# Altium schematic sheet 10.SchDoc
size 297 x 209 mm
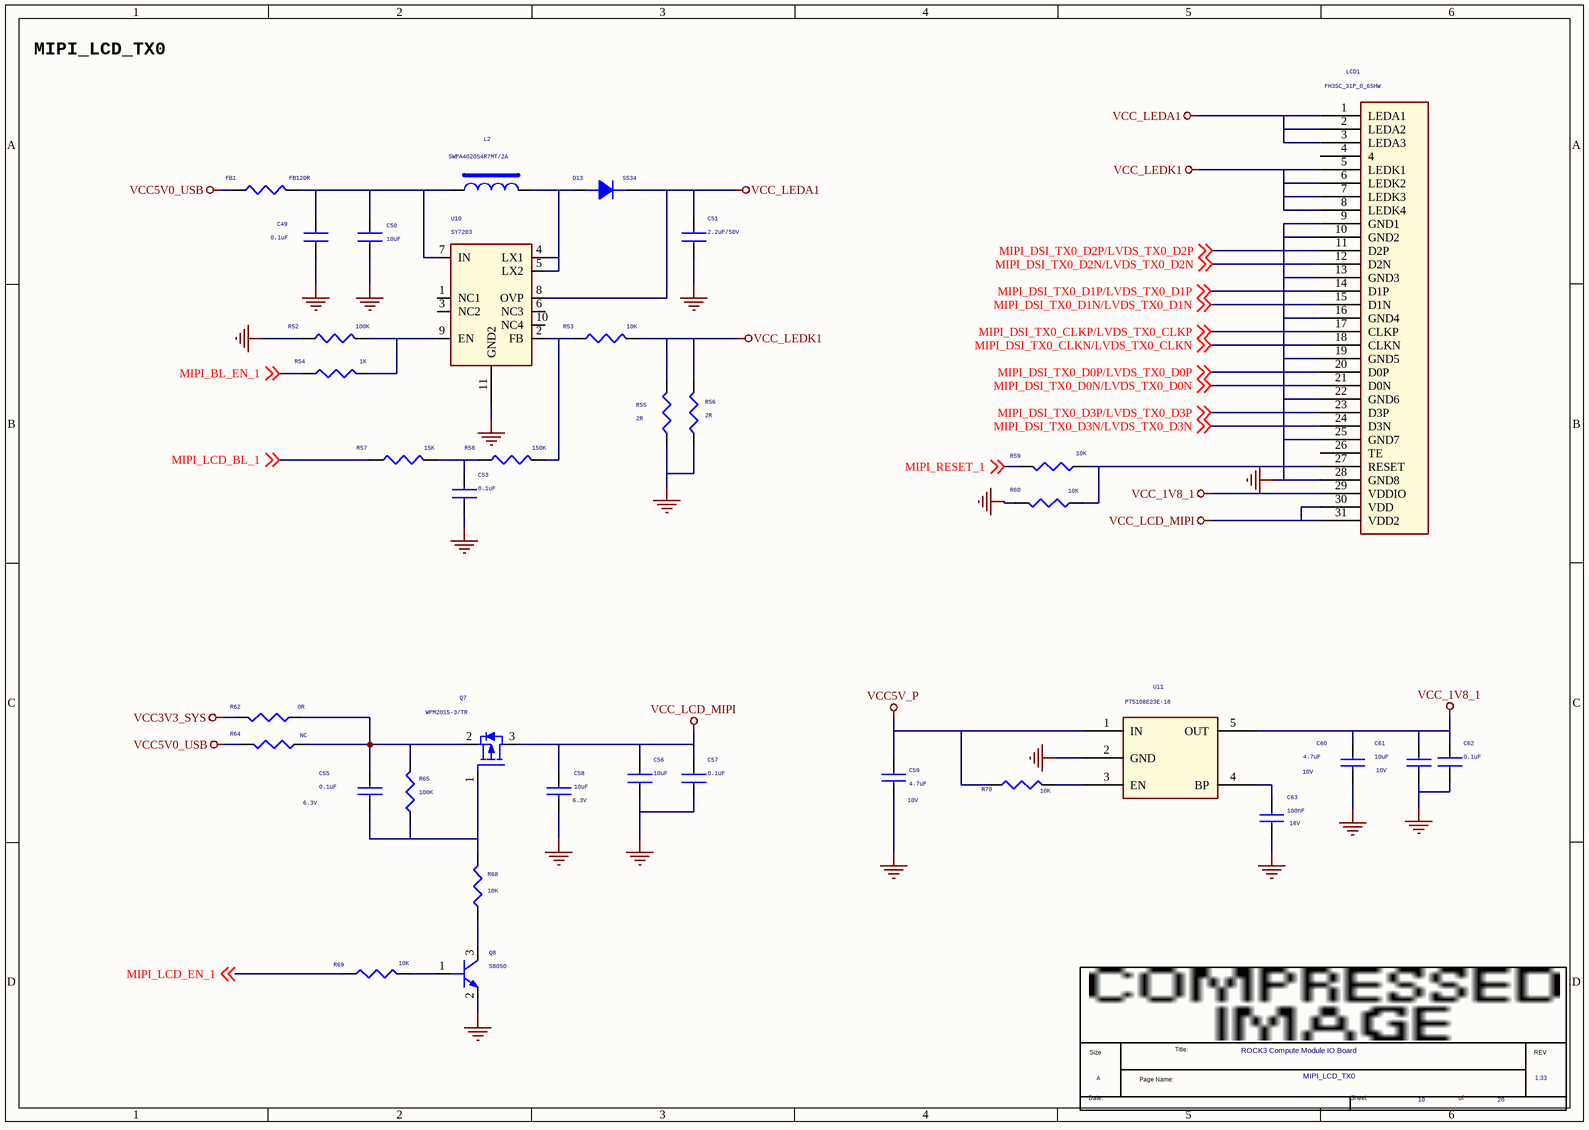
[diagram p0: 10.SchDoc]

## Parts
*  Page Count: 20  Page Number: 10  Page Size: A  Title: ROCK3 Compute Module IO Board  RevCode: 1.33  Doc: MIPI_LCD_TX0  (hidden comment: radxa_1010)  (graphical)
C49  0.1uF  [C0603]
C50  10uF  [C0603]
C51  2.2uF/50V  [C0603]
C53  0.1uF  [C0603]
C55  0.1uF  Voltage: 6.3V  [C0402]
C56  10uF  [C0603]
C57  0.1uF  [C0603]
C58  10uF  Voltage: 6.3V  [C0603]
C59  4.7uF  Voltage: 10V  [C0603]
C60  4.7uF  Voltage: 10V  [C0603]
C61  10uF  Voltage: 10V  [C0603]
C62  0.1uF  [C0603]
C63  100nF  Voltage: 16V  [C0402]
D13  SS34  [DO214AC]
FB1  FB120R  [R0603]
L2  SWPA4020S4R7MT/2A  [IND-4X4]
LCD1  FH35C_31P_0_6SHW  [HQ101WX001]
Q7  WPM2015-3/TR  [SOT23]
Q8  S8050  [SOT23]
R52  100K  [R0402]
R53  10K  [R0402]
R54  1K  [R0402]
R55  2R  [R0805]
R56  2R  [R0805]
R57  15K  [R0402]
R58  150K  [R0402]
R59  10K  [R0402]
R60  10K  [R0402]
R62  0R  [R0603]
R64  NC  [R0603]
R65  100K  [R0402]
R68  10K  [R0402]
R69  10K  [R0402]
R70  10K  [R0402]
U10  SY7203  [QFN8-2X2]
U11  PT5108E23E-18  [SOT25]

## Nets
GND: C49.2 C50.2 C51.2 C53.1 C56.2 C57.2 C58.2 C59.2 C60.2 C61.2 C62.2 C63.2 LCD1.9(GND1) LCD1.10(GND2) LCD1.13(GND3) LCD1.16(GND4) LCD1.19(GND5) LCD1.22(GND6) LCD1.25(GND7) LCD1.28(GND8) Q8.2(EMITTER) R52.1 R55.2 R56.2 R60.2 U10.11(GND2) U11.2(GND)
VCC3V3_SYS: R62.1
VCC5V0_USB: FB1.1 R64.1
VCC5V_P: C59.1 R70.1 U11.1(IN)
VCC_1V8_1: C60.1 C61.1 C62.1 LCD1.29(VDDIO) U11.5(OUT)
VCC_LCD_MIPI: C56.1 C57.1 C58.1 LCD1.30(VDD) LCD1.31(VDD2) Q7.3(DRAIN)
VCC_LEDA1: C51.1 D13.2(K) LCD1.1(LEDA1) LCD1.2(LEDA2) LCD1.3(LEDA3) U10.8(OVP)
VCC_LEDK1: LCD1.5(LEDK1) LCD1.6(LEDK2) LCD1.7(LEDK3) LCD1.8(LEDK4) R53.2 R55.1 R56.1
MIPI_BL_EN_1: R54.1 ; off-sheet MIPI_BL_EN_1
MIPI_DSI_TX0_CLKN/LVDS_TX0_CLKN: LCD1.18(CLKN) ; off-sheet MIPI_DSI_TX0_CLKN/LVDS_TX0_CLKN
MIPI_DSI_TX0_CLKP/LVDS_TX0_CLKP: LCD1.17(CLKP) ; off-sheet MIPI_DSI_TX0_CLKP/LVDS_TX0_CLKP
MIPI_DSI_TX0_D0N/LVDS_TX0_D0N: LCD1.21(D0N) ; off-sheet MIPI_DSI_TX0_D0N/LVDS_TX0_D0N
MIPI_DSI_TX0_D0P/LVDS_TX0_D0P: LCD1.20(D0P) ; off-sheet MIPI_DSI_TX0_D0P/LVDS_TX0_D0P
MIPI_DSI_TX0_D1N/LVDS_TX0_D1N: LCD1.15(D1N) ; off-sheet MIPI_DSI_TX0_D1N/LVDS_TX0_D1N
MIPI_DSI_TX0_D1P/LVDS_TX0_D1P: LCD1.14(D1P) ; off-sheet MIPI_DSI_TX0_D1P/LVDS_TX0_D1P
MIPI_DSI_TX0_D2N/LVDS_TX0_D2N: LCD1.12(D2N) ; off-sheet MIPI_DSI_TX0_D2N/LVDS_TX0_D2N
MIPI_DSI_TX0_D2P/LVDS_TX0_D2P: LCD1.11(D2P) ; off-sheet MIPI_DSI_TX0_D2P/LVDS_TX0_D2P
MIPI_DSI_TX0_D3N/LVDS_TX0_D3N: LCD1.24(D3N) ; off-sheet MIPI_DSI_TX0_D3N/LVDS_TX0_D3N
MIPI_DSI_TX0_D3P/LVDS_TX0_D3P: LCD1.23(D3P) ; off-sheet MIPI_DSI_TX0_D3P/LVDS_TX0_D3P
MIPI_LCD_BL_1: R57.1 ; off-sheet MIPI_LCD_BL_1
MIPI_LCD_EN_1: R69.1 ; off-sheet MIPI_LCD_EN_1
MIPI_RESET_1: R59.2 ; off-sheet MIPI_RESET_1
NetC49_1: C49.1 C50.1 FB1.2 L2.1 U10.7(IN)
NetC53_2: C53.2 R57.2 R58.1
NetC55_1: C55.1 Q7.2(SOURCE) R62.2 R64.2 R65.1
NetC55_2: C55.2 Q7.1(GATE) R65.2 R68.1
NetC63_1: C63.1 U11.4(BP)
NetD13_1: D13.1(A) L2.2 U10.4(LX1) U10.5(LX2)
NetLCD1_27: LCD1.27(RESET) R59.1 R60.1
NetQ8_1: Q8.1(BASE) R69.2
NetQ8_3: Q8.3(COLLECTOR) R68.2
NetR52_2: R52.2 R54.2 U10.9(EN)
NetR53_1: R53.1 R58.2 U10.2(FB)
NetR70_2: R70.2 U11.3(EN)

Not connected (* = marked no-connect by the designer): LCD1 4 26(TE); U10 1(NC1) 3(NC2) 6(NC3) 10(NC4)

## Notes on the sheet
- MIPI_LCD_TX0
- (in symbol radxa_1010) Title:; Size; REV; Page Name:; Date:; Sheet; of

## Library data of the parts
C49 C57 C62 = CAP NP: CAP,MLCC,100nF,+/-10%,X7R,6.3V,SMD0402
C50 = CAP NP
C51 = CAP NP: RoHS CHIP CAP 1uF +10/-10% 25V X5R
C53 = CAP NP: RoHS CHIP CAP 0.1uF +10/-10% X7R
C55 = CAP NP_0: cap,100.00nF,+/-10%,6.3V,X5R,C0402; Manufacturer PN: C1005X5R0J104K050BA; Manufacturer: TDK; Tolerance: 10%; Priority: A; Dielectric: X5R; Created by: JJJ; Part Type: C0402; RK PN: C1005X5R0J104K050BA
C56 = CAP NP: CAP,MLCC,4.7uF,+/-10%,X5R,6.3V,SMD0603
C58 = CAP NP_0: cap,4.70uF,+/-10%,6.3V,X5R,C0603; Manufacturer PN: C1608X5R0J475K080AB; Manufacturer: TDK; Tolerance: 10%; Priority: A; Dielectric: X5R; Created by: JJJ; Part Type: C0603; RK PN: C1608X5R0J475K080AB
C59 C60 = CAP NP_0: cap,4.70uF,+/-10%,10V,X5R,C0603; Manufacturer PN: C1608X5R1A475K080AC; Manufacturer: TDK; Tolerance: 10%; Priority: A; Dielectric: X5R; Created by: JJJ; Part Type: C0603; RK PN: C1608X5R1A475K080AC
C61 = CAP NP_0: cap,10.00uF,+/-10%,10V,X5R,C0805; Manufacturer PN: C2012X5R1A106K125AB; Manufacturer: TDK; Tolerance: 10%; Priority: A; Dielectric: X5R; Created by: JJJ; Part Type: C0805; RK PN: C2012X5R1A106K125AB
C63 = CAP NP_0: cap,100.00nF,+/-10%,16V,X5R,C0402; Manufacturer: TDK; RK PN: C1005X5R1C104K050BA; Priority: A; Tolerance: 10%; Dielectric: X5R; Part Type: C0402; Manufacturer PN: C1005X5R1C104K050BA; Created by: JJJ
D13 = DIODE
FB1 R52 R57-R60 = RES 1B: ROHS CHIP RES 4.7K 1/16W 5%
L2 = INDUCTORS OF FERRITE
LCD1 = HQ101WX001
Q7 = MOSFET P_Dup1: PMOS,WPM2015-3/TR,SOT23,Id=2.4A,Vds=20V; Manufacturer: WillSemi(韦尔半导体); Pd: 0.5W; Vgsth: 0.62V; VDS: 20V; Vgs: ±8V; Id: 2.4A; Priority: A; Created by: JJJ; Manufacturer PN: WPM2015-3/TR; Part Type: PMOS; RK PN: WPM2015-3/TR
Q8 = NPN: S8050 SOT23; Manufacturer: 长电; Manufacturer PN: S8050_SOT23; Priority: A; Ic: 0.5A; Vceo: 25V; Pc: 0.3W; RK PN: S8050; Part Type: NPN; Created by: JJJ
R53 = RES 1B: ROHS CHIP RES 82K 1/16W 5%
R54 R70 = RESISTOR_0: 通用厚膜电阻,10K,+/-5%,R0402,1/16W.; Manufacturer: YAGEO; Tolerance: 5%; RK PN: RC0402JR-0710KL; Priority: A; Wattage: 1/16W; Part Type: 通用厚膜电阻; Manufacturer PN: RC0402JR-0710KL; Created by: YTL
R55 R56 R62 R64 = RES 1B: ROHS CHIP RES 4.7R 1/4W 5%
R65 = RESISTOR_0: 通用厚膜电阻,100K,+/-5%,R0402,1/16W.; Manufacturer PN: RC0402JR-07100KL; Manufacturer: YAGEO; Tolerance: 5%; Wattage: 1/16W; Priority: A; Created by: YTL; Part Type: 通用厚膜电阻; RK PN: RC0402JR-07100KL
R68 R69 = RESISTOR_0: 通用厚膜电阻,10K,+/-5%,R0402,1/16W.; Manufacturer PN: RC0402JR-0710KL; Manufacturer: YAGEO; Tolerance: 5%; Wattage: 1/16W; Priority: A; Created by: YTL; Part Type: 通用厚膜电阻; RK PN: RC0402JR-0710KL
U10 = MP3202-QFN8_1
U11 = LDO_PT5108: 500mA, Low Dropout, Low Noise Ultra-Fast Without Bypass Capacitor CMOS LDO Regulator; Manufacturer: Richtek（立錡）; Manufacturer PN: RT9013-30GB; Option: /CE75B30M; RK PN: RT9013-30B; Priority: A; Part Type: LDO; Created by: JJJ
* = radxa_1010: Page Create Date: March  8, 1995